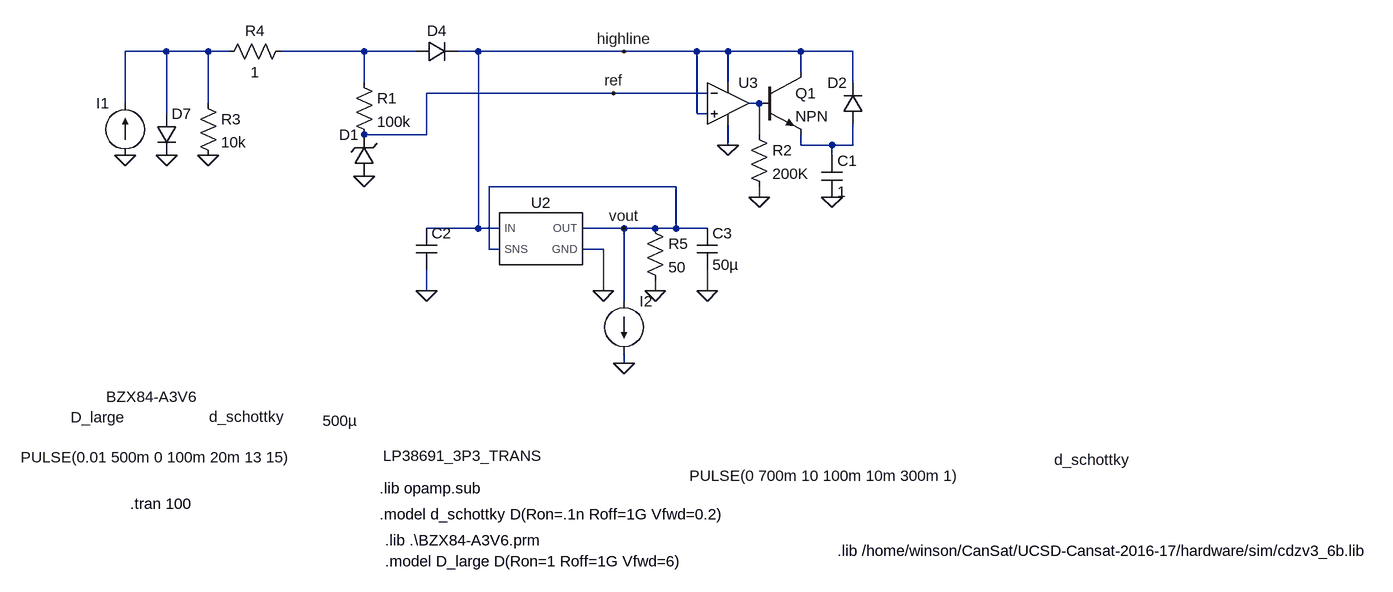
[diagram p0: schematic sim1_pretty.asc]
sim1_pretty.asc, the LTspice schematic file:
Version 4
SHEET 1 1684 784
WIRE -400 -16 -464 -16
WIRE -336 -16 -400 -16
WIRE -304 -16 -336 -16
WIRE -96 -16 -224 -16
WIRE -16 -16 -96 -16
WIRE 80 -16 48 -16
WIRE 304 -16 80 -16
WIRE 416 -16 304 -16
WIRE 464 -16 416 -16
WIRE 576 -16 464 -16
WIRE 656 -16 576 -16
WIRE 576 16 576 -16
WIRE -96 32 -96 -16
WIRE 464 32 464 -16
WIRE 656 32 656 -16
WIRE 288 48 0 48
WIRE 432 48 288 48
WIRE -464 64 -464 -16
WIRE -336 64 -336 -16
WIRE 512 64 496 64
WIRE -400 80 -400 -16
WIRE 416 80 416 -16
WIRE 432 80 416 80
WIRE 0 112 0 48
WIRE 0 112 -96 112
WIRE 512 112 512 64
WIRE 464 128 464 96
WIRE 576 128 576 112
WIRE 624 128 576 128
WIRE 656 128 656 96
WIRE 656 128 624 128
WIRE 624 144 624 128
WIRE 384 192 96 192
WIRE 512 208 512 192
WIRE 80 256 80 -16
WIRE 80 256 0 256
WIRE 112 256 80 256
WIRE 304 256 240 256
WIRE 352 256 304 256
WIRE 384 256 384 192
WIRE 384 256 352 256
WIRE 432 256 384 256
WIRE 96 288 96 192
WIRE 112 288 96 288
WIRE 272 288 240 288
WIRE 0 352 0 320
WIRE 272 352 272 288
WIRE 352 352 352 336
WIRE 432 352 432 320
WIRE 304 368 304 256
WIRE 304 464 304 448
FLAG -464 144 0
FLAG 624 208 0
FLAG 0 352 0
FLAG 432 352 0
FLAG 272 352 0
FLAG 512 208 0
FLAG -336 144 0
FLAG 464 128 0
FLAG 352 352 0
FLAG -400 144 0
FLAG 288 48 ref
FLAG 304 -16 highline
FLAG 304 256 vout
FLAG 304 464 0
FLAG -96 176 0
SYMBOL current -464 144 R180
WINDOW 0 24 80 Left 2
WINDOW 3 -258 -464 Left 2
WINDOW 123 0 0 Left 2
WINDOW 39 0 0 Left 2
SYMATTR InstName I1
SYMATTR Value PULSE(0.01 500m 0 100m 20m 13 15)
SYMBOL diode 672 96 R180
WINDOW 0 24 64 Left 2
WINDOW 3 -410 -516 Left 2
SYMATTR InstName D2
SYMATTR Value d_schottky
SYMBOL cap 608 144 R0
SYMATTR InstName C1
SYMATTR Value 1
SYMBOL cap -16 256 R0
WINDOW 3 -144 296 Left 2
SYMATTR InstName C2
SYMATTR Value 500µ
SYMBOL cap 416 256 R0
SYMATTR InstName C3
SYMATTR Value 50µ
SYMBOL LP38691_3P3_TRANS 176 272 R0
WINDOW 3 -119 318 Top 2
SYMATTR InstName U2
SYMBOL diode -16 0 R270
WINDOW 0 32 32 VTop 2
WINDOW 3 -530 -261 VBottom 2
SYMATTR InstName D4
SYMATTR Value d_schottky
SYMBOL res 496 96 R0
SYMATTR InstName R2
SYMATTR Value 200K
SYMBOL res -352 48 R0
SYMATTR InstName R3
SYMATTR Value 10k
SYMBOL res -208 -32 R90
WINDOW 0 0 56 VBottom 2
WINDOW 3 32 56 VTop 2
SYMATTR InstName R4
SYMATTR Value 1
SYMBOL Opamps\\UniversalOpamp2 464 64 R0
SYMATTR InstName U3
SYMBOL res 336 240 R0
SYMATTR InstName R5
SYMATTR Value 50
SYMBOL diode -416 80 R0
WINDOW 3 -132 467 Left 2
SYMATTR InstName D7
SYMATTR Value D_large
SYMBOL npn 512 16 R0
SYMATTR InstName Q1
SYMBOL res -112 16 R0
SYMATTR InstName R1
SYMATTR Value 100k
SYMBOL current 304 368 R0
WINDOW 123 0 0 Left 2
WINDOW 39 0 0 Left 2
WINDOW 3 101 269 Left 2
SYMATTR InstName I2
SYMATTR Value PULSE(0 700m 10 100m 10m 300m 1)
SYMBOL zener -80 176 R180
WINDOW 0 24 64 Left 2
WINDOW 3 273 -339 Left 2
SYMATTR InstName D1
SYMATTR Value BZX84-A3V6
TEXT -456 680 Left 2 !.tran 100
TEXT -72 656 Left 2 !.lib opamp.sub
TEXT -72 696 Left 2 !.model d_schottky D(Ron=.1n Roff=1G Vfwd=0.2)
TEXT -64 736 Left 2 !.lib .\\BZX84-A3V6.prm
TEXT -64 768 Left 2 !.model D_large D(Ron=1 Roff=1G Vfwd=6)
TEXT 632 752 Left 2 !.lib /home/winson/CanSat/UCSD-Cansat-2016-17/hardware/sim/cdzv3_6b.lib

The netlist it stands for:
* sim1_pretty.asc
I1 0 N001 PULSE(0.01 500m 0 100m 20m 13 15)
D2 N004 highline d_schottky
C1 N004 0 1
C2 highline 0 500µ
C3 vout 0 50µ
XU2 highline vout vout 0 LP38691_3P3_TRANS  ; pins IN SNS OUT GND
D4 N002 highline d_schottky
R2 N003 0 200K
R3 N001 0 10k
R4 N002 N001 1
XU3 highline ref highline 0 N003 level.2 Avol=1Meg GBW=10Meg Slew=10Meg ilimit=25m rail=0 Vos=0 phimargin=45 en=0 enk=0 in=0 ink=0 Rin=500Meg  ; pins IN+ IN- V+ V- OUT
R5 vout 0 50
D7 N001 0 D_large
Q1 highline N003 N004 0 NPN
R1 N002 ref 100k
I2 vout 0 PULSE(0 700m 10 100m 10m 300m 1)
D1 0 ref BZX84-A3V6
.model D D
.lib standard.dio
.model NPN NPN
.model PNP PNP
.lib standard.bjt
.tran 100
.lib opamp.sub
.model d_schottky D(Ron=.1n Roff=1G Vfwd=0.2)
.lib .\BZX84-A3V6.prm
.model D_large D(Ron=1 Roff=1G Vfwd=6)
.lib /home/winson/CanSat/UCSD-Cansat-2016-17/hardware/sim/cdzv3_6b.lib
.lib .\lp38691_3p3_trans.lib
.lib UniversalOpamps2.sub
.backanno
.end